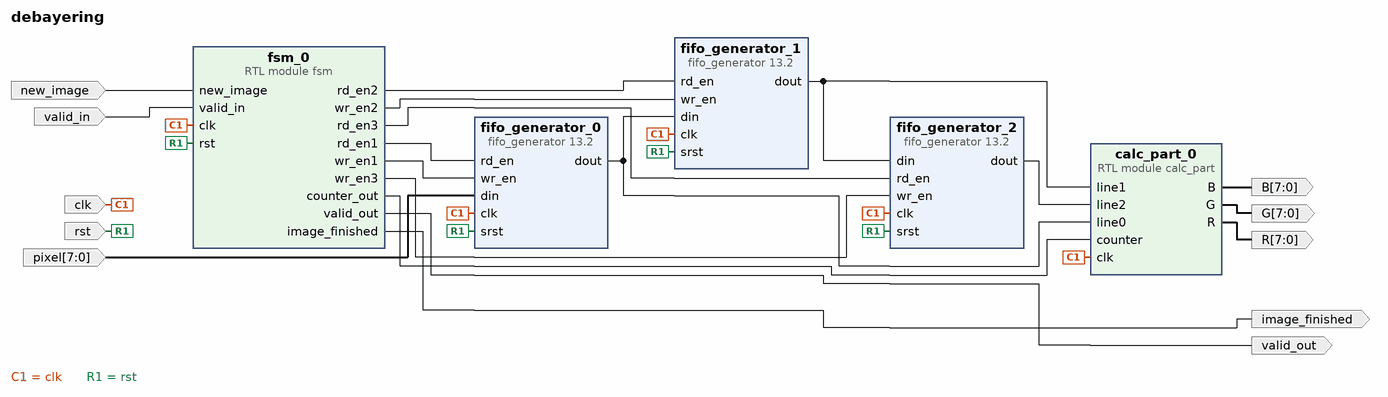
[diagram p0: block diagram of the top level]
# Vivado block design debayering, xc7z010clg400-1, Vivado 2018.2
create_bd_design debayering

create_bd_port -dir I clk
create_bd_port -dir I rst
create_bd_port -dir I new_image
create_bd_port -dir I valid_in
create_bd_port -dir O valid_out
create_bd_port -dir O image_finished
create_bd_port -dir O -from 7 -to 0 R
create_bd_port -dir O -from 7 -to 0 G
create_bd_port -dir O -from 7 -to 0 B
create_bd_port -dir I -from 7 -to 0 pixel

create_bd_cell -type ip -vlnv xilinx.com:ip:fifo_generator:13.2 fifo_generator_0
set_property -dict {CONFIG.Input_Data_Width 8 CONFIG.Output_Data_Width 8} [get_bd_cells fifo_generator_0]
create_bd_cell -type ip -vlnv xilinx.com:ip:fifo_generator:13.2 fifo_generator_1
set_property -dict {CONFIG.Input_Data_Width 8 CONFIG.Output_Data_Width 8} [get_bd_cells fifo_generator_1]
create_bd_cell -type ip -vlnv xilinx.com:ip:fifo_generator:13.2 fifo_generator_2
set_property -dict {CONFIG.Input_Data_Width 8 CONFIG.Output_Data_Width 8} [get_bd_cells fifo_generator_2]
create_bd_cell -type module -reference calc_part calc_part_0
create_bd_cell -type module -reference fsm fsm_0

# ---- connections ----

connect_bd_net [get_bd_pins fifo_generator_1/dout] [get_bd_pins fifo_generator_2/din] [get_bd_pins calc_part_0/line1]
connect_bd_net [get_bd_pins fifo_generator_2/dout] [get_bd_pins calc_part_0/line2]
connect_bd_net [get_bd_ports clk] \
  [get_bd_pins fifo_generator_2/clk] [get_bd_pins fifo_generator_1/clk] [get_bd_pins fifo_generator_0/clk] \
  [get_bd_pins calc_part_0/clk] [get_bd_pins fsm_0/clk]
connect_bd_net [get_bd_pins fsm_0/counter_out] [get_bd_pins calc_part_0/counter]
connect_bd_net [get_bd_pins fsm_0/rd_en1] [get_bd_pins fifo_generator_0/rd_en]
connect_bd_net [get_bd_pins fsm_0/rd_en2] [get_bd_pins fifo_generator_1/rd_en]
connect_bd_net [get_bd_pins fsm_0/rd_en3] [get_bd_pins fifo_generator_2/rd_en]
connect_bd_net [get_bd_ports rst] \
  [get_bd_pins fifo_generator_0/srst] [get_bd_pins fifo_generator_1/srst] [get_bd_pins fifo_generator_2/srst] \
  [get_bd_pins fsm_0/rst]
connect_bd_net [get_bd_ports new_image] [get_bd_pins fsm_0/new_image]
connect_bd_net [get_bd_ports valid_in] [get_bd_pins fsm_0/valid_in]
connect_bd_net [get_bd_pins fsm_0/valid_out] [get_bd_ports valid_out]
connect_bd_net [get_bd_pins fsm_0/image_finished] [get_bd_ports image_finished]
connect_bd_net [get_bd_pins calc_part_0/R] [get_bd_ports R]
connect_bd_net [get_bd_pins calc_part_0/G] [get_bd_ports G]
connect_bd_net [get_bd_pins calc_part_0/B] [get_bd_ports B]
connect_bd_net [get_bd_ports pixel] [get_bd_pins fifo_generator_0/din]
connect_bd_net [get_bd_pins fifo_generator_0/dout] [get_bd_pins fifo_generator_1/din] [get_bd_pins calc_part_0/line0]
connect_bd_net [get_bd_pins fsm_0/wr_en1] [get_bd_pins fifo_generator_0/wr_en]
connect_bd_net [get_bd_pins fsm_0/wr_en2] [get_bd_pins fifo_generator_1/wr_en]
connect_bd_net [get_bd_pins fsm_0/wr_en3] [get_bd_pins fifo_generator_2/wr_en]

validate_bd_design
save_bd_design
